# Altium schematic sheet output3.SchDoc
size A4
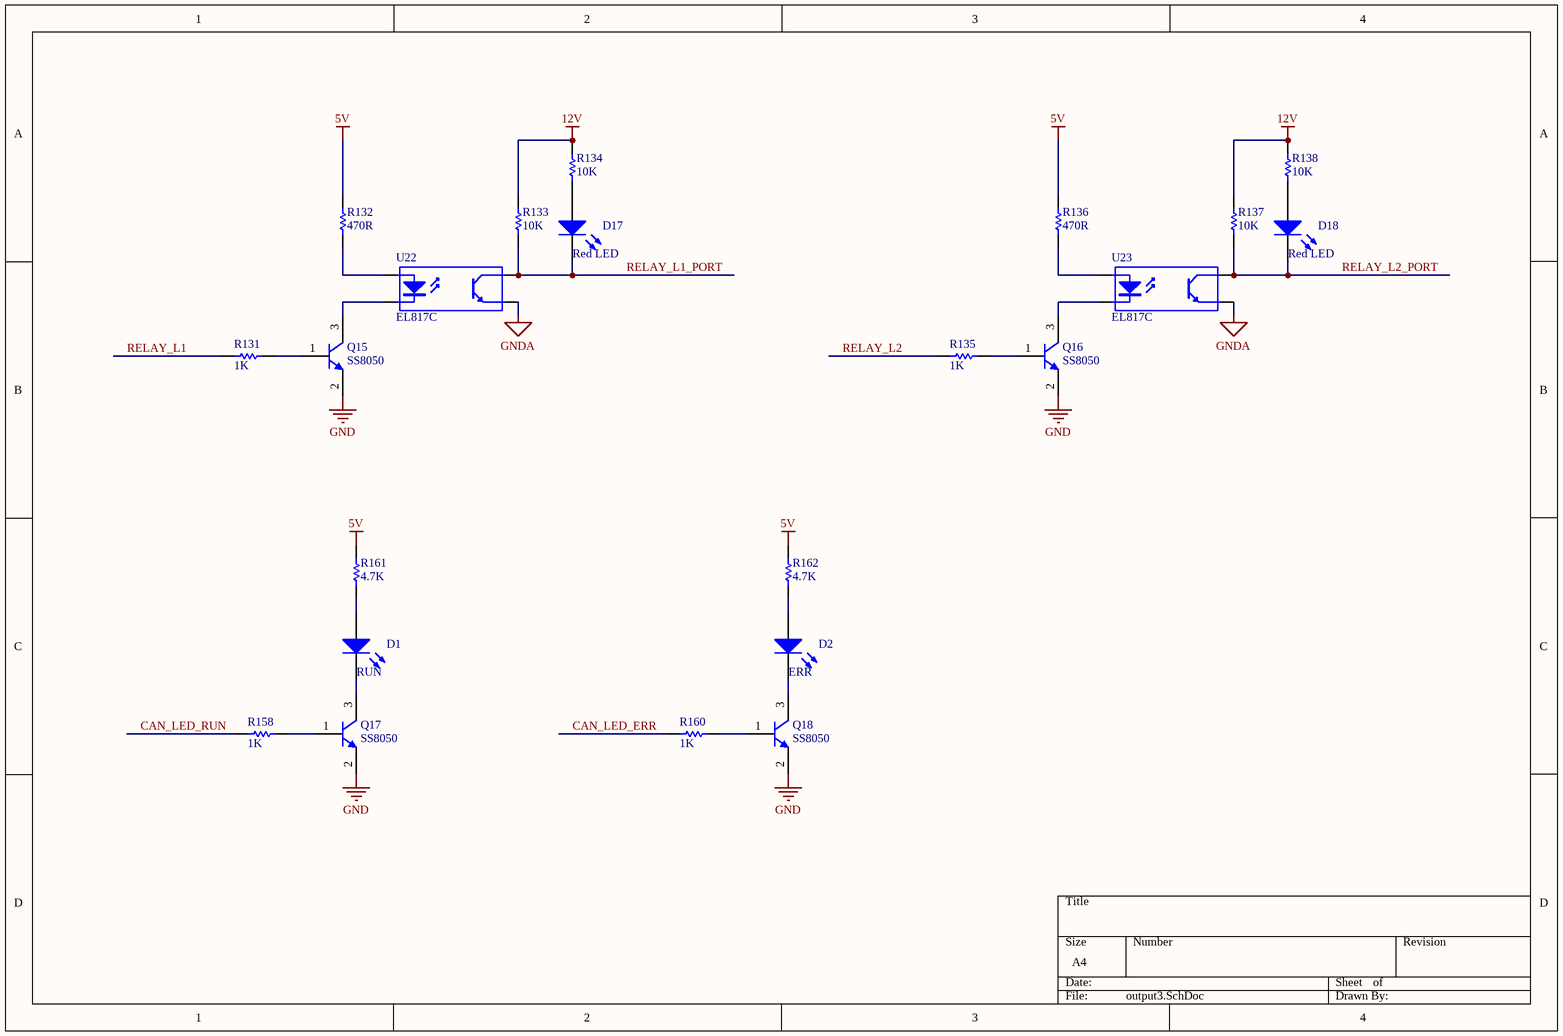
[diagram p0: output3.SchDoc]

## Parts
D1  RUN  [CD2012-0805]
D2  ERR  [CD2012-0805]
D17  Red LED  [LED254A]
D18  Red LED  [LED254A]
Q15  SS8050  [SOT-23_N]
Q16  SS8050  [SOT-23_N]
Q17  SS8050  [SOT-23_N]
Q18  SS8050  [SOT-23_N]
R131  1K  [RESC2012M]
R132  470R  [RESC2012M]
R133  10K  [RESC2012M]
R134  10K  [RESC2012M]
R135  1K  [RESC2012M]
R136  470R  [RESC2012M]
R137  10K  [RESC2012M]
R138  10K  [RESC2012M]
R158  1K  [RESC2012M]
R160  1K  [RESC2012M]
R161  4.7K  [RESC2012M]
R162  4.7K  [RESC2012M]
U22  EL817C  [SO-4LA]
U23  EL817C  [SO-4LA]

## Nets
5V: R132.1 R136.1 R161.1 R162.1
12V: R133.2 R134.1 R137.2 R138.1
GND: Q15.2(E) Q16.2(E) Q17.2(E) Q18.2(E)
GNDA: U22.3(E) U23.3(E)
CAN_LED_ERR: R160.1
CAN_LED_RUN: R158.1
RELAY_L1: R131.1
RELAY_L1_PORT: D17.2(K) R133.1 U22.4(C)
RELAY_L2: R135.1
RELAY_L2_PORT: D18.2(K) R137.1 U23.4(C)
NetD1_1: D1.1(A) R161.2
NetD1_2: D1.2(K) Q17.3(C)
NetD2_1: D2.1(A) R162.2
NetD2_2: D2.2(K) Q18.3(C)
NetD17_1: D17.1(A) R134.2
NetD18_1: D18.1(A) R138.2
NetQ15_1: Q15.1(B) R131.2
NetQ15_3: Q15.3(C) U22.2(K)
NetQ16_1: Q16.1(B) R135.2
NetQ16_3: Q16.3(C) U23.2(K)
NetQ17_1: Q17.1(B) R158.2
NetQ18_1: Q18.1(B) R160.2
NetR132_2: R132.2 U22.1(A)
NetR136_2: R136.2 U23.1(A)

## Library data of the parts
D1 = LED1: Green LED,Can bus indicator for run status.; Published: 8-Jun-2000; LatestRevisionDate: 08-Jul-2005; LatestRevisionNote: Mech Layer 1 removed.; PackageReference: LED-1; Publisher: Altium Limited
D2 = LED1: Red LED,Can bus indicator for err status.; Published: 8-Jun-2000; LatestRevisionDate: 08-Jul-2005; LatestRevisionNote: Mech Layer 1 removed.; PackageReference: LED-1; Publisher: Altium Limited
D17 D18 = LED1: Red LED ,SIP, Dia =3mm; Published: 8-Jun-2000; LatestRevisionDate: 08-Jul-2005; LatestRevisionNote: Mech Layer 1 removed.; PackageReference: LED-1; Publisher: Altium Limited
Q15-Q18 = PMMT491A: NPN BISS Transistor; Published: 17-Sep-2003; LatestRevisionDate: 12-Dec-2006; LatestRevisionNote: IPC-7351 Footprint Added.; DatasheetVersion: 11-Jun-2001; PackageVersion: May-1999; PackageReference: SOT23; Publisher: Altium Limited; PackageDescription: 3-Pin SOT-23 Package 0.95 mm Pitch, 2.3 mm Lead Span; ComponentLink1Description: Manufacturer Link; ComponentLink1URL: http://www.semiconductors.philips.com/; ComponentLink2Description: Datasheet; ComponentLink2URL: http://www.semiconductors.philips.com/acrobat/datasheets/PMMT491A_5.pdf
R131 R132 R135 R136 R158 R160-R162 = Res1: Resistor; Value: 10K; Published: 8-Jun-2000; LatestRevisionDate: 17-Jul-2002; LatestRevisionNote: Re-released for DXP Platform.; PackageReference: AXIAL-0.3; Publisher: Altium Limited
R133 R134 R137 R138 = Res1: Resistor; Published: 8-Jun-2000; LatestRevisionDate: 17-Jul-2002; LatestRevisionNote: Re-released for DXP Platform.; PackageReference: AXIAL-0.3; Publisher: Altium Limited; Value: 10K
U22 U23 = Optoisolator1: 4-Pin Phototransistor Optocoupler; Published: 24-Mar-1999; LatestRevisionDate: 04-Mar-2005; LatestRevisionNote: Sch pins 3 & 4 Swapped.; DatasheetVersion: Nov-2003; PackageReference: DIP-4; Publisher: Altium Limited